# Altium schematic sheet hv_io_gpio.SchDoc
size A4; Organization: Badgerloop; Address1: 133 Engineering Research; Address2: Building; Address3: Madison, WI 53715
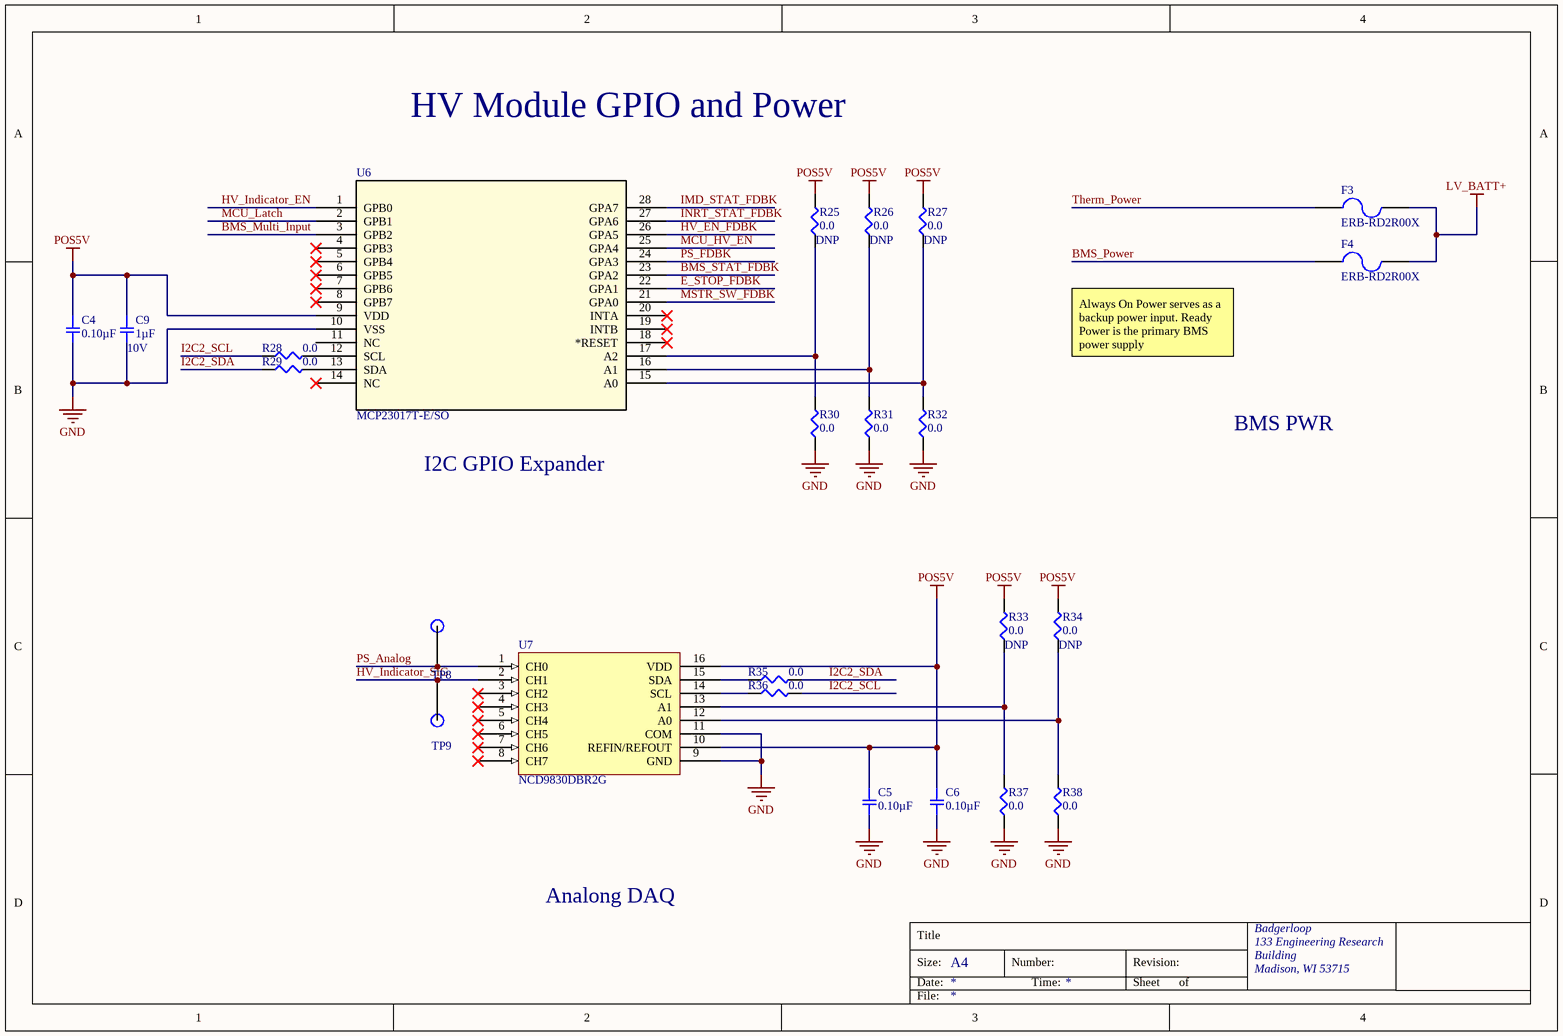
[diagram p0: hv_io_gpio.SchDoc]

## Parts
C4  0.10µF  [SMD-0805C]
C5  0.10µF  [SMD-0805C]
C6  0.10µF  [SMD-0805C]
C9  1µF  Voltage: 10V  [SMD-0402C]
F3  ERB-RD2R00X  [SMD-0402-RES]
F4  ERB-RD2R00X  [SMD-0402-RES]
R25  0.0  [SMD-0402-RES]
R26  0.0  [SMD-0402-RES]
R27  0.0  [SMD-0402-RES]
R28  0.0  [SMD-0402-RES]
R29  0.0  [SMD-0402-RES]
R30  0.0  [SMD-0402-RES]
R31  0.0  [SMD-0402-RES]
R32  0.0  [SMD-0402-RES]
R33  0.0  [SMD-0402-RES]
R34  0.0  [SMD-0402-RES]
R35  0.0  [SMD-0402-RES]
R36  0.0  [SMD-0402-RES]
R37  0.0  [SMD-0402-RES]
R38  0.0  [SMD-0402-RES]
TP8  TP  [Test Point]  (value not drawn)
TP9  TP  [Test Point]  (value not drawn)
U6  MCP23017T-E/SO  [SOIC28-W_MC-M]
U7  NCD9830DBR2G  [TSOP65P640X120_HS-17N]

## Nets
GND: C4.2 C5.2 C6.2 C9.2 R30.1 R31.1 R32.1 R37.1 R38.1 U6.10(VSS) U7.9(GND) U7.11(COM)
LV_BATT+: F3.2 F4.2
POS5V: C4.1 C5.1 C6.1 C9.1 R25.2 R26.2 R27.2 R33.2 R34.2 U6.9(VDD) U7.10(REFIN/REFOUT) U7.16(VDD)
BMS_Multi_Input: U6.3(GPB2)
BMS_Power: F4.1
BMS_STAT_FDBK: U6.23(GPA2)
E_STOP_FDBK: U6.22(GPA1)
HV_EN_FDBK: U6.26(GPA5)
HV_Indicator_EN: U6.1(GPB0)
HV_Indicator_SIG: TP9.1 U7.2(CH1)
I2C2_SCL: R28.1 R36.2
I2C2_SDA: R29.1 R35.2
IMD_STAT_FDBK: U6.28(GPA7)
INRT_STAT_FDBK: U6.27(GPA6)
MCU_HV_EN: U6.25(GPA4)
MCU_Latch: U6.2(GPB1)
MSTR_SW_FDBK: U6.21(GPA0)
PS_Analog: TP8.1 U7.1(CH0)
PS_FDBK: U6.24(GPA3)
Therm_Power: F3.1
NetR25_1: R25.1 R30.2 U6.17(A2)
NetR26_1: R26.1 R31.2 U6.16(A1)
NetR27_1: R27.1 R32.2 U6.15(A0)
NetR28_2: R28.2 U6.12(SCL)
NetR29_2: R29.2 U6.13(SDA)
NetR33_1: R33.1 R37.2 U7.13(A1)
NetR34_1: R34.1 R38.2 U7.12(A0)
NetR35_1: R35.1 U7.15(SDA)
NetR36_1: R36.1 U7.14(SCL)

Not connected (* = marked no-connect by the designer): U6 4(GPB3)* 5(GPB4)* 6(GPB5)* 7(GPB6)* 8(GPB7)* 11(NC) 14(NC)* 18(*RESET)* 19(INTB)* 20(INTA)*; U7 3(CH2)* 4(CH3)* 5(CH4)* 6(CH5)* 7(CH6)* 8(CH7)*

## Notes on the sheet
- HV Module GPIO and Power
- Always On Power serves as a backup power input. Ready Power is the primary BMS power supply
- BMS PWR
- I2C GPIO Expander
- Analong DAQ
- Title
- Size:
- Date:
- A4
- Number:
- Time:
- Revision:
- Sheet
- of
- File:

## Library data of the parts
C4-C6 = GCJ21BR71H104KA01L: CAP CER 0.1UF 50V X7R 0805; Manufacturer: Murata Electronics North America; Factory Stock: 0; Unit Price (USD): 0.24; Minimum Quantity: 1; Tolerance: ±10%; Datasheets: http://www.murata.com/~/media/webrenewal/support/library/catalog/products/capacitor/mlcc/c03e.ashx; Image: //media.digikey.com/Renders/Murata%20Renders/0805%20(2012%20Metric)%20.85mm.jpg; Digi-Key Part Number: 490-5803-1-ND; Part Number: GCJ21BR71H104KA01L; Quantity Available: 700; @ qty: 0; Packaging: Cut Tape (CT); Series: GCJ; Part Status: Active; Value: 0.10µF; Voltage: 50V; Temperature Coefficient: X7R; Operating Temperature: -55°C ~ 125°C; Features: Soft Termination; Ratings: AEC-Q200; Applications: Automotive, Boardflex Sensitive; Mounting Type: Surface Mount, MLCC; Package / Case: 0805 (2012 Metric); Size / Dimension: 0.079" L x 0.049" W (2.00mm x 1.25mm); Height - Seated (Max): -; Thickness (Max): 0.057" (1.45mm); Lead Spacing: -; Lead Style: -
C9 = GCM155C71A105KE38D: CAP CER 1UF 10V X7S 0402; Manufacturer: Murata Electronics North America; Factory Stock: 0; Unit Price (USD): 0.12; Minimum Quantity: 1; Tolerance: ±10%; Datasheets: http://www.murata.com/~/media/webrenewal/support/library/catalog/products/capacitor/mlcc/c03e.ashx; Image: //media.digikey.com/Renders/Murata%20Renders/ZRB-SERIES-0402.jpg; Digikey P/N: 490-13409-1-ND; Part Number: GCM155C71A105KE38D; Quantity Available: 7240; @ qty: 0; Packaging: Cut Tape (CT); Series: GCM; Part Status: Active; Value: 1µF; Temperature Coefficient: X7S; Operating Temperature: -55°C ~ 125°C; Features: -; Ratings: AEC-Q200; Applications: Automotive; Mounting Type: Surface Mount, MLCC; Package / Case: 0402 (1005 Metric); Size / Dimension: 0.039" L x 0.020" W (1.00mm x 0.50mm); Height - Seated (Max): -; Thickness (Max): 0.022" (0.55mm); Lead Spacing: -; Lead Style: -
F3 F4 = ERB-RD2R00X: FUSE BOARD MOUNT 2A 32VDC 0402; Manufacturer: Panasonic; Manufacturer P/N: ERB-RD2R00X; Digikey P/N: P15123TR-ND; Digikey Link: https://www.digikey.com/product-detail/en/panasonic-electronic-components/ERB-RD2R00X/P15123TR-ND/2796785
R25-R38 = ERJ-2GE0R00X: RES SMD 0.0OHM JUMPER 1/10W 0402; Manufacturer: Panasonic Electronic Components; Factory Stock: 0; Unit Price (USD): 0.00384; @ qty: 1500; Minimum Quantity: 1; Power (Watts): 0.1W, 1/10W; Part Number: ERJ-2GE0R00X; Datasheets: http://industrial.panasonic.com/www-cgi/jvcr13pz.cgi?E+PZ+3+AOA0001+ERJ2GE0R00X+7+WW; Image: //media.digikey.com/Photos/Panasonic%20Photos/ERJ-PA2-Series.jpg; Digi-Key Part Number: P0.0JCT-ND; Quantity Available: 3152483; Packaging: Cut Tape (CT); Series: ERJ; Part Status: Active; Value: 0.0; Tolerance: Jumper; Composition: Thick Film; Features: Automotive AEC-Q200; Temperature Coefficient: -; Operating Temperature: -55°C ~ 155°C; Package / Case: 0402 (1005 Metric); Supplier Device Package: 0402; Size / Dimension: 0.039" L x 0.020" W (1.00mm x 0.50mm); Height - Seated (Max): 0.016" (0.40mm); Number of Terminations: 2; Failure Rate: -; Digikey P/N: ERJ-2GE0R00X
  R25-R27 R33 R34: DNP: DNP
U6 = MCP23017T-E/SO: IC I/O EXPANDER I2C 16B 28SOIC; Manufacturer: Microchip; Manufacturer P/N: MCP23017T-E/SO; Digikey P/N: MCP23017T-E/SOCT-ND; Digikey Link: https://www.digikey.com/product-detail/en/microchip-technology/MCP23017T-E-SO/MCP23017T-E-SOCT-ND/5358289
U7 = NCD9830DBR2G: IC ADC 8BIT 8CH I2C 16TSSOP; Manufacturer: ON Semiconductor; Digikey P/N: NCD9830DBR2GOSCT-ND; Digikey Link: https://www.digikey.com/product-detail/en/on-semiconductor/NCD9830DBR2G/NCD9830DBR2GOSCT-ND/9086945; Cost: 2.70; Manufacturer P/N: NCD9830DBR2G